# EAGLE design oshcamp23-badge-topper-RevA1 (EAGLE 9.6.2)
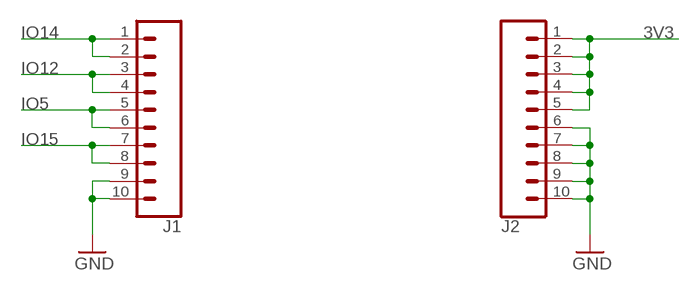
[diagram p0: schematic, sheet 1]

## Parts
J1  CONN_10LOCK  [1X10_LOCK]
J2  CONN_10LOCK  [1X10_LOCK]

## Nets
3V3: J2.1 J2.2 J2.3 J2.4 J2.5
GND: J1.9 J1.10 J2.6 J2.7 J2.8 J2.9 J2.10
IO5: J1.5 J1.6
IO12: J1.3 J1.4
IO14: J1.1 J1.2
IO15: J1.7 J1.8

## Library data of the parts
J1 J2 = SparkFun-Connectors:CONN_10: Multi connection point. Often used as Generic Header-pin footprint for 0.1 inch spaced/style header connections On any of the 0.1 inch spaced packages, you can populate with these: Break Away Headers - Straight <https://www.sparkfun.com/products/116> (PRT-00116) Break Away Male Headers - Right Angle <https://www.sparkfun.com/products/553> (PRT-00553) Female Headers <https://www.sparkfun.com/products/115> (PRT-00115) Break Away Headers - Machine Pin <https://www.sparkfun.com/products/117> (PRT-00117) Break Away Female Headers - Swiss Machine Pin <https://www.sparkfun.com/products/743> (PRT-00743) Arduino Stackable Header - 10 Pin <https://www.sparkfun.com/products/11376> (PRT-11376) For SCREWTERMINALS and SPRING TERMINALS visit here: Screw Terimnals on SparkFun.com <https://www.sparkfun.com/search/results?term=Screw+Terminals> (5mm/3.5mm/2.54mm spacing) This device is also useful as a general connection point to wire up your design to another part of your project. Our various solder wires solder well into these plated through hole pads. Hook-Up Wire - Assortment (Stranded, 22 AWG) <https://www.sparkfun.com/products/11375> (PRT-11375) Hook-Up Wire - Assortment (Solid Core, 22 AWG) <https://www.sparkfun.com/products/11367> (PRT-11367) View the entire wire category on our website here <https://www.sparkfun.com/categories/141> Special notes: Molex polarized connector foot print use with SKU : PRT-08231 with associated crimp pins and housings. 1MM SMD Version SKU: PRT-10208 NOTES ON THE VARIANTS LOCK and LOCK_LONGPADS... This footprint was designed to help hold the alignment of a through-hole component (i.e. 6-pin header) while soldering it into place. You may notice that each hole has been shifted either up or down by 0.005 of an inch from it's more standard position (which is a perfectly straight line). This slight alteration caused the pins (the squares in the middle) to touch the edges of the holes. Because they are alternating, it causes a "brace" to hold the component in place. 0.005 has proven to be the perfect amount of "off-center" position when using our standard breakaway headers. Although looks a little odd when you look at the bare footprint, once you have a header in there, the alteration is very hard to notice. Also,if you push a header all the way into place, it is covered up entirely on the bottom side.

## Board
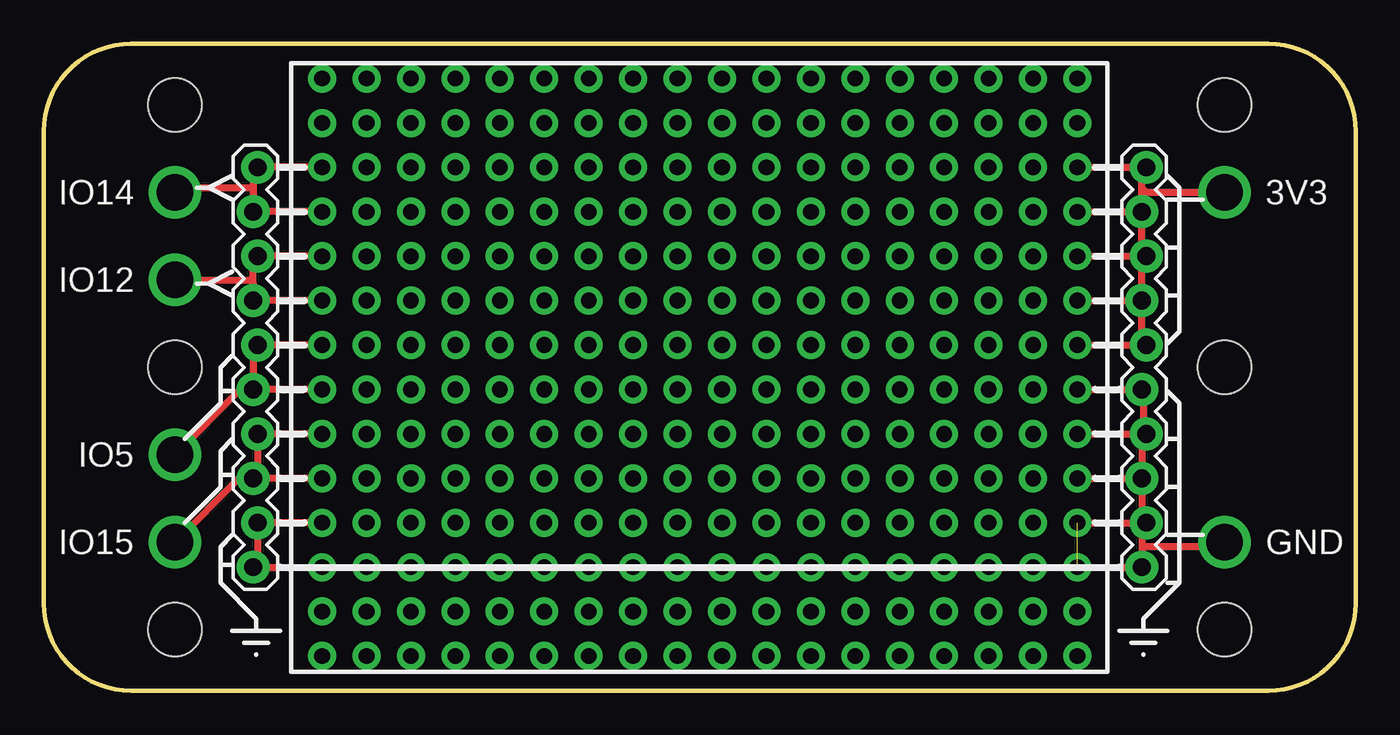
[diagram p1: board, top side]
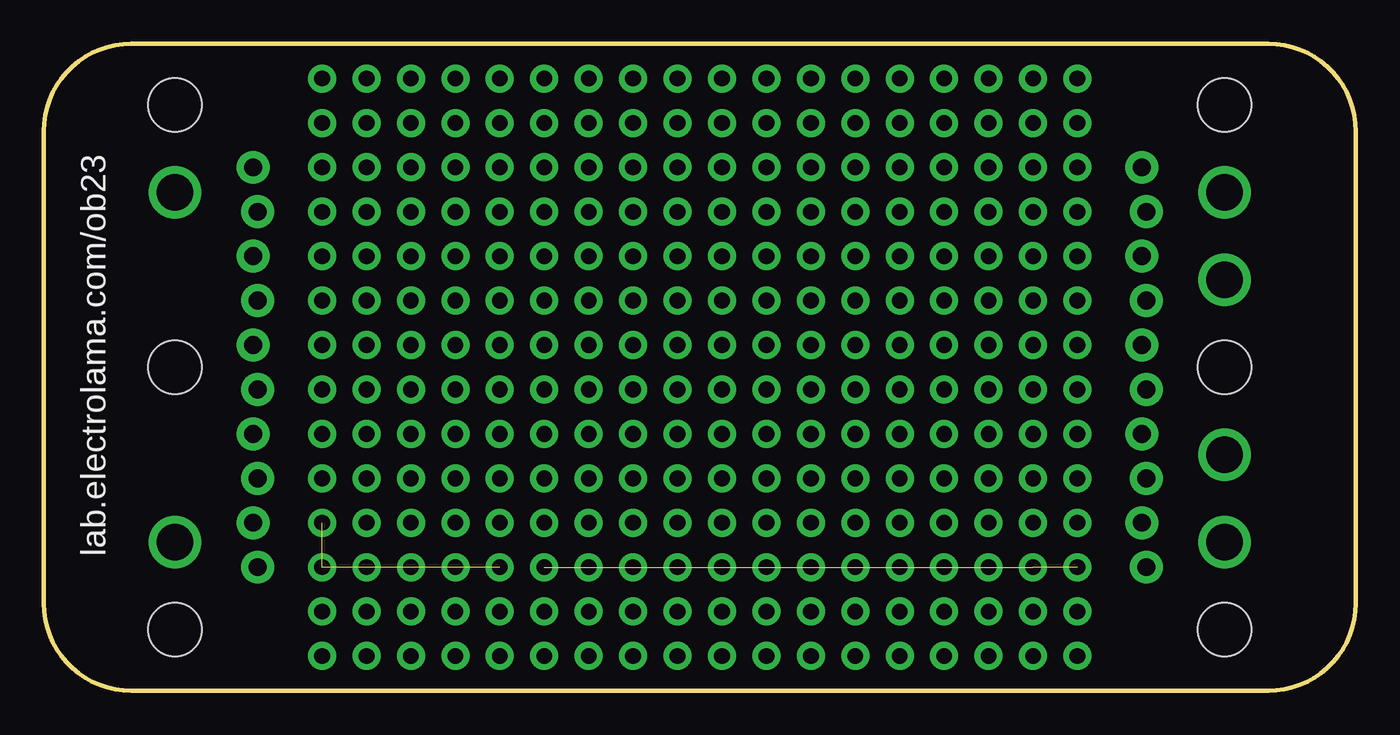
[diagram p2: board, bottom side, seen from below]

Size 75 x 37 mm. Coordinates in mm from the lower left corner, seen from the top.
Outline: 70,37 5,37 arc90 0,32 0,5 arc90 5,0 70,0 arc90 75,5 75,32 arc90 70,37
Copper layers (1*16): Top 0.035mm / dielectric 1.6mm / Bottom 0.035mm
Design rules "jlcpcb-2layers *": minimum track width 5mil, minimum drill 0.3mm, track to track 5mil, track to pad 5mil, pad to pad 5mil, via to via 5mil, smd to smd 5mil, copper to edge 0.2mm, drill to drill 6mil, minimum pad ring 10mil, minimum via ring 3mil, stop-mask expansion 4mil, vias tented up to drill 100mil, thermal gap 10mil
Holes 3.05 mm at 67.5,33.5 67.5,18.5 67.5,3.5 7.5,33.5 7.5,18.5 7.5,3.5

### Footprints (pad centres in the part's own frame; a part is rotated, then mirrored left to right if it is on the bottom)
1X10_LOCK = drill 1.016 pad 1.88: 1 0,0.127; 2 2.54,-0.127; 3 5.08,0.127; 4 7.62,-0.127; 5 10.16,0.127; 6 12.7,-0.127; 7 15.24,0.127; 8 17.78,-0.127; 9 20.32,0.127; 10 22.86,-0.127

### Placement (x,y rotation side)
J1  12.1,29.93 270 top
J2  62.9,29.93 270 top

### Tracks (layer width: path | path; a pad name or v marks a point on that pad's centre or on a via)
3V3  (via drill 0.9 pad 1.6, 2.1 pad 3)
  Top 0.406: v59.09,19.77 J2.5 62.77,20.02 J2.4 | v59.09,22.31 J2.4 | v59.09,24.85 J2.3 | v59.09,27.39 J2.2 | v59.09,29.93 J2.1 62.77,29.68 62.77,28.77 | J2.4 62.77,24.6 J2.3 | J2.3 62.77,25.1 J2.2 | J2.2 62.77,28.77 | v67.5,28.5 63.05,28.5 62.77,28.77
GND  (via drill 0.9 pad 1.6, 2.1 pad 3)  (17 unrouted)
  Top 0.406: v59.09,9.61 J2.9 | v59.09,12.15 J2.8 | v59.09,14.69 62.84,14.69 | 62.84,14.69 J2.7 62.77,14.44 J2.8 | v59.09,17.23 J2.6 62.84,17.16 62.84,14.69 | v15.91,9.61 J1.9 12.23,7.32 J1.10 v15.91,7.07 J2.10 62.77,8.22 | J2.8 62.77,9.86 J2.9 | J2.9 62.77,9.36 62.77,8.22 | v67.5,8.5 67.22,8.22 62.77,8.22
  other vias: 59.09,7.07 18.45,7.07 20.99,7.07 31.15,7.07 41.31,7.07 43.85,7.07 48.93,7.07 51.47,7.07 54.01,7.07 56.55,7.07 38.77,7.07 36.23,7.07 33.69,7.07 28.61,7.07 26.07,7.07 23.53,7.07 46.39,7.07
IO5  (via drill 0.9 pad 1.6, 2.1 pad 3)
  Top 0.406: 11.97,17.82 11.97,19.52 J1.5 v15.91,19.77 | 11.97,17.82 J1.6 11.23,17.23 v7.5,13.5 | v15.91,17.23 12.56,17.23 11.97,17.82
IO12  (via drill 0.9 pad 1.6, 2.1 pad 3)
  Top 0.406: 11.97,23.3 J1.4 v15.91,22.31 | 11.97,23.3 11.97,24.6 J1.3 v15.91,24.85 | v7.5,23.5 11.77,23.5 11.97,23.3
IO14  (via drill 0.9 pad 1.6, 2.1 pad 3)
  Top 0.406: 11.97,28.77 11.97,29.68 J1.1 v15.91,29.93 | 11.97,28.77 11.97,27.41 | 11.97,27.41 J1.2 | v7.5,28.5 7.77,28.77 11.97,28.77 | v15.91,27.39 11.99,27.39 11.97,27.41
IO15  (via drill 0.9 pad 1.6, 2.1 pad 3)
  Top 0.406: v7.5,8.5 11.15,12.15 J1.8 12.23,12.4 | 12.23,12.4 J1.7 v15.91,14.69 | v15.91,12.15 12.48,12.15 12.23,12.4
N$1  (via drill 0.9 pad 1.6)
  other vias: 36.23,19.77
N$2  (via drill 0.9 pad 1.6)
  other vias: 38.77,19.77
N$3  (via drill 0.9 pad 1.6)
  other vias: 36.23,17.23
N$4  (via drill 0.9 pad 1.6)
  other vias: 38.77,17.23
N$5  (via drill 0.9 pad 1.6)
  other vias: 41.31,19.77
N$6  (via drill 0.9 pad 1.6)
  other vias: 43.85,19.77
N$7  (via drill 0.9 pad 1.6)
  other vias: 41.31,17.23
N$8  (via drill 0.9 pad 1.6)
  other vias: 43.85,17.23
N$9  (via drill 0.9 pad 1.6)
  other vias: 46.39,19.77
N$10  (via drill 0.9 pad 1.6)
  other vias: 48.93,19.77
N$11  (via drill 0.9 pad 1.6)
  other vias: 46.39,17.23
N$12  (via drill 0.9 pad 1.6)
  other vias: 48.93,17.23
N$13  (via drill 0.9 pad 1.6)
  other vias: 51.47,19.77
N$14  (via drill 0.9 pad 1.6)
  other vias: 54.01,19.77
N$15  (via drill 0.9 pad 1.6)
  other vias: 51.47,17.23
N$16  (via drill 0.9 pad 1.6)
  other vias: 54.01,17.23
N$17  (via drill 0.9 pad 1.6)
  other vias: 56.55,19.77
N$19  (via drill 0.9 pad 1.6)
  other vias: 56.55,17.23
N$21  (via drill 0.9 pad 1.6)
  other vias: 31.15,19.77
N$22  (via drill 0.9 pad 1.6)
  other vias: 33.69,19.77
N$23  (via drill 0.9 pad 1.6)
  other vias: 31.15,17.23
N$24  (via drill 0.9 pad 1.6)
  other vias: 33.69,17.23
N$25  (via drill 0.9 pad 1.6)
  other vias: 26.07,19.77
N$26  (via drill 0.9 pad 1.6)
  other vias: 28.61,19.77
N$27  (via drill 0.9 pad 1.6)
  other vias: 26.07,17.23
N$28  (via drill 0.9 pad 1.6)
  other vias: 28.61,17.23
N$29  (via drill 0.9 pad 1.6)
  other vias: 20.99,19.77
N$30  (via drill 0.9 pad 1.6)
  other vias: 23.53,19.77
N$31  (via drill 0.9 pad 1.6)
  other vias: 20.99,17.23
N$32  (via drill 0.9 pad 1.6)
  other vias: 23.53,17.23
N$34  (via drill 0.9 pad 1.6)
  other vias: 18.45,19.77
N$36  (via drill 0.9 pad 1.6)
  other vias: 18.45,17.23
N$38  (via drill 0.9 pad 1.6)
  other vias: 18.45,24.85
N$40  (via drill 0.9 pad 1.6)
  other vias: 18.45,22.31
N$41  (via drill 0.9 pad 1.6)
  other vias: 20.99,24.85
N$42  (via drill 0.9 pad 1.6)
  other vias: 23.53,24.85
N$43  (via drill 0.9 pad 1.6)
  other vias: 20.99,22.31
N$44  (via drill 0.9 pad 1.6)
  other vias: 23.53,22.31
N$45  (via drill 0.9 pad 1.6)
  other vias: 26.07,24.85
N$46  (via drill 0.9 pad 1.6)
  other vias: 28.61,24.85
N$47  (via drill 0.9 pad 1.6)
  other vias: 26.07,22.31
N$48  (via drill 0.9 pad 1.6)
  other vias: 28.61,22.31
N$49  (via drill 0.9 pad 1.6)
  other vias: 31.15,24.85
N$50  (via drill 0.9 pad 1.6)
  other vias: 33.69,24.85
N$51  (via drill 0.9 pad 1.6)
  other vias: 31.15,22.31
N$52  (via drill 0.9 pad 1.6)
  other vias: 33.69,22.31
N$53  (via drill 0.9 pad 1.6)
  other vias: 36.23,24.85
N$54  (via drill 0.9 pad 1.6)
  other vias: 38.77,24.85
N$55  (via drill 0.9 pad 1.6)
  other vias: 36.23,22.31
N$56  (via drill 0.9 pad 1.6)
  other vias: 38.77,22.31
N$57  (via drill 0.9 pad 1.6)
  other vias: 41.31,24.85
N$58  (via drill 0.9 pad 1.6)
  other vias: 43.85,24.85
N$59  (via drill 0.9 pad 1.6)
  other vias: 41.31,22.31
N$60  (via drill 0.9 pad 1.6)
  other vias: 43.85,22.31
N$61  (via drill 0.9 pad 1.6)
  other vias: 46.39,24.85
N$62  (via drill 0.9 pad 1.6)
  other vias: 48.93,24.85
N$63  (via drill 0.9 pad 1.6)
  other vias: 46.39,22.31
N$64  (via drill 0.9 pad 1.6)
  other vias: 48.93,22.31
N$65  (via drill 0.9 pad 1.6)
  other vias: 51.47,24.85
N$66  (via drill 0.9 pad 1.6)
  other vias: 54.01,24.85
N$67  (via drill 0.9 pad 1.6)
  other vias: 51.47,22.31
N$68  (via drill 0.9 pad 1.6)
  other vias: 54.01,22.31
N$70  (via drill 0.9 pad 1.6)
  other vias: 18.45,29.93
N$72  (via drill 0.9 pad 1.6)
  other vias: 18.45,27.39
N$73  (via drill 0.9 pad 1.6)
  other vias: 20.99,29.93
N$74  (via drill 0.9 pad 1.6)
  other vias: 23.53,29.93
N$75  (via drill 0.9 pad 1.6)
  other vias: 20.99,27.39
N$76  (via drill 0.9 pad 1.6)
  other vias: 23.53,27.39
N$77  (via drill 0.9 pad 1.6)
  other vias: 15.91,35.01
N$78  (via drill 0.9 pad 1.6)
  other vias: 18.45,35.01
N$79  (via drill 0.9 pad 1.6)
  other vias: 15.91,32.47
N$80  (via drill 0.9 pad 1.6)
  other vias: 18.45,32.47
N$81  (via drill 0.9 pad 1.6)
  other vias: 20.99,35.01
N$82  (via drill 0.9 pad 1.6)
  other vias: 23.53,35.01
N$83  (via drill 0.9 pad 1.6)
  other vias: 20.99,32.47
N$84  (via drill 0.9 pad 1.6)
  other vias: 23.53,32.47
N$85  (via drill 0.9 pad 1.6)
  other vias: 26.07,29.93
N$86  (via drill 0.9 pad 1.6)
  other vias: 28.61,29.93
N$87  (via drill 0.9 pad 1.6)
  other vias: 26.07,27.39
N$88  (via drill 0.9 pad 1.6)
  other vias: 28.61,27.39
N$89  (via drill 0.9 pad 1.6)
  other vias: 31.15,29.93
N$90  (via drill 0.9 pad 1.6)
  other vias: 33.69,29.93
N$91  (via drill 0.9 pad 1.6)
  other vias: 31.15,27.39
N$92  (via drill 0.9 pad 1.6)
  other vias: 33.69,27.39
N$93  (via drill 0.9 pad 1.6)
  other vias: 26.07,35.01
N$94  (via drill 0.9 pad 1.6)
  other vias: 28.61,35.01
N$95  (via drill 0.9 pad 1.6)
  other vias: 26.07,32.47
N$96  (via drill 0.9 pad 1.6)
  other vias: 28.61,32.47
N$97  (via drill 0.9 pad 1.6)
  other vias: 31.15,35.01
N$98  (via drill 0.9 pad 1.6)
  other vias: 33.69,35.01
N$99  (via drill 0.9 pad 1.6)
  other vias: 31.15,32.47
N$100  (via drill 0.9 pad 1.6)
  other vias: 33.69,32.47
N$101  (via drill 0.9 pad 1.6)
  other vias: 36.23,29.93
N$102  (via drill 0.9 pad 1.6)
  other vias: 38.77,29.93
N$103  (via drill 0.9 pad 1.6)
  other vias: 36.23,27.39
N$104  (via drill 0.9 pad 1.6)
  other vias: 38.77,27.39
N$105  (via drill 0.9 pad 1.6)
  other vias: 41.31,29.93
N$106  (via drill 0.9 pad 1.6)
  other vias: 43.85,29.93
N$107  (via drill 0.9 pad 1.6)
  other vias: 41.31,27.39
N$108  (via drill 0.9 pad 1.6)
  other vias: 43.85,27.39
N$109  (via drill 0.9 pad 1.6)
  other vias: 36.23,35.01
N$110  (via drill 0.9 pad 1.6)
  other vias: 38.77,35.01
N$111  (via drill 0.9 pad 1.6)
  other vias: 36.23,32.47
N$112  (via drill 0.9 pad 1.6)
  other vias: 38.77,32.47
N$113  (via drill 0.9 pad 1.6)
  other vias: 41.31,35.01
N$114  (via drill 0.9 pad 1.6)
  other vias: 43.85,35.01
N$115  (via drill 0.9 pad 1.6)
  other vias: 41.31,32.47
N$116  (via drill 0.9 pad 1.6)
  other vias: 43.85,32.47
N$117  (via drill 0.9 pad 1.6)
  other vias: 46.39,29.93
N$118  (via drill 0.9 pad 1.6)
  other vias: 48.93,29.93
N$119  (via drill 0.9 pad 1.6)
  other vias: 46.39,27.39
N$120  (via drill 0.9 pad 1.6)
  other vias: 48.93,27.39
N$121  (via drill 0.9 pad 1.6)
  other vias: 51.47,29.93
N$122  (via drill 0.9 pad 1.6)
  other vias: 54.01,29.93
N$123  (via drill 0.9 pad 1.6)
  other vias: 51.47,27.39
N$124  (via drill 0.9 pad 1.6)
  other vias: 54.01,27.39
N$125  (via drill 0.9 pad 1.6)
  other vias: 46.39,35.01
N$126  (via drill 0.9 pad 1.6)
  other vias: 48.93,35.01
N$127  (via drill 0.9 pad 1.6)
  other vias: 46.39,32.47
N$128  (via drill 0.9 pad 1.6)
  other vias: 48.93,32.47
N$129  (via drill 0.9 pad 1.6)
  other vias: 51.47,35.01
N$130  (via drill 0.9 pad 1.6)
  other vias: 54.01,35.01
N$131  (via drill 0.9 pad 1.6)
  other vias: 51.47,32.47
N$132  (via drill 0.9 pad 1.6)
  other vias: 54.01,32.47
N$133  (via drill 0.9 pad 1.6)
  other vias: 56.55,24.85
N$135  (via drill 0.9 pad 1.6)
  other vias: 56.55,22.31
N$137  (via drill 0.9 pad 1.6)
  other vias: 56.55,29.93
N$139  (via drill 0.9 pad 1.6)
  other vias: 56.55,27.39
N$141  (via drill 0.9 pad 1.6)
  other vias: 56.55,35.01
N$142  (via drill 0.9 pad 1.6)
  other vias: 59.09,35.01
N$143  (via drill 0.9 pad 1.6)
  other vias: 56.55,32.47
N$144  (via drill 0.9 pad 1.6)
  other vias: 59.09,32.47
N$145  (via drill 0.9 pad 1.6)
  other vias: 38.77,4.53
N$146  (via drill 0.9 pad 1.6)
  other vias: 38.77,1.99
N$147  (via drill 0.9 pad 1.6)
  other vias: 41.31,4.53
N$148  (via drill 0.9 pad 1.6)
  other vias: 43.85,4.53
N$149  (via drill 0.9 pad 1.6)
  other vias: 41.31,1.99
N$150  (via drill 0.9 pad 1.6)
  other vias: 43.85,1.99
N$151  (via drill 0.9 pad 1.6)
  other vias: 46.39,4.53
N$152  (via drill 0.9 pad 1.6)
  other vias: 48.93,4.53
N$153  (via drill 0.9 pad 1.6)
  other vias: 46.39,1.99
N$154  (via drill 0.9 pad 1.6)
  other vias: 48.93,1.99
N$155  (via drill 0.9 pad 1.6)
  other vias: 51.47,4.53
N$156  (via drill 0.9 pad 1.6)
  other vias: 54.01,4.53
N$157  (via drill 0.9 pad 1.6)
  other vias: 51.47,1.99
N$158  (via drill 0.9 pad 1.6)
  other vias: 54.01,1.99
N$159  (via drill 0.9 pad 1.6)
  other vias: 38.77,9.61
N$161  (via drill 0.9 pad 1.6)
  other vias: 41.31,9.61
N$162  (via drill 0.9 pad 1.6)
  other vias: 43.85,9.61
N$165  (via drill 0.9 pad 1.6)
  other vias: 38.77,14.69
N$166  (via drill 0.9 pad 1.6)
  other vias: 38.77,12.15
N$167  (via drill 0.9 pad 1.6)
  other vias: 41.31,14.69
N$168  (via drill 0.9 pad 1.6)
  other vias: 43.85,14.69
N$169  (via drill 0.9 pad 1.6)
  other vias: 41.31,12.15
N$170  (via drill 0.9 pad 1.6)
  other vias: 43.85,12.15
N$171  (via drill 0.9 pad 1.6)
  other vias: 46.39,9.61
N$172  (via drill 0.9 pad 1.6)
  other vias: 48.93,9.61
N$175  (via drill 0.9 pad 1.6)
  other vias: 51.47,9.61
N$176  (via drill 0.9 pad 1.6)
  other vias: 54.01,9.61
N$179  (via drill 0.9 pad 1.6)
  other vias: 46.39,14.69
N$180  (via drill 0.9 pad 1.6)
  other vias: 48.93,14.69
N$181  (via drill 0.9 pad 1.6)
  other vias: 46.39,12.15
N$182  (via drill 0.9 pad 1.6)
  other vias: 48.93,12.15
N$183  (via drill 0.9 pad 1.6)
  other vias: 51.47,14.69
N$184  (via drill 0.9 pad 1.6)
  other vias: 54.01,14.69
N$185  (via drill 0.9 pad 1.6)
  other vias: 51.47,12.15
N$186  (via drill 0.9 pad 1.6)
  other vias: 54.01,12.15
N$187  (via drill 0.9 pad 1.6)
  other vias: 56.55,4.53
N$188  (via drill 0.9 pad 1.6)
  other vias: 59.09,4.53
N$189  (via drill 0.9 pad 1.6)
  other vias: 56.55,1.99
N$190  (via drill 0.9 pad 1.6)
  other vias: 59.09,1.99
N$191  (via drill 0.9 pad 1.6)
  other vias: 56.55,9.61
N$195  (via drill 0.9 pad 1.6)
  other vias: 56.55,14.69
N$197  (via drill 0.9 pad 1.6)
  other vias: 56.55,12.15
N$199  (via drill 0.9 pad 1.6)
  other vias: 15.91,4.53
N$200  (via drill 0.9 pad 1.6)
  other vias: 15.91,1.99
N$201  (via drill 0.9 pad 1.6)
  other vias: 18.45,4.53
N$202  (via drill 0.9 pad 1.6)
  other vias: 20.99,4.53
N$203  (via drill 0.9 pad 1.6)
  other vias: 18.45,1.99
N$204  (via drill 0.9 pad 1.6)
  other vias: 20.99,1.99
N$205  (via drill 0.9 pad 1.6)
  other vias: 23.53,4.53
N$206  (via drill 0.9 pad 1.6)
  other vias: 26.07,4.53
N$207  (via drill 0.9 pad 1.6)
  other vias: 23.53,1.99
N$208  (via drill 0.9 pad 1.6)
  other vias: 26.07,1.99
N$209  (via drill 0.9 pad 1.6)
  other vias: 28.61,4.53
N$210  (via drill 0.9 pad 1.6)
  other vias: 31.15,4.53
N$211  (via drill 0.9 pad 1.6)
  other vias: 28.61,1.99
N$212  (via drill 0.9 pad 1.6)
  other vias: 31.15,1.99
N$215  (via drill 0.9 pad 1.6)
  other vias: 18.45,9.61
N$216  (via drill 0.9 pad 1.6)
  other vias: 20.99,9.61
N$221  (via drill 0.9 pad 1.6)
  other vias: 18.45,14.69
N$222  (via drill 0.9 pad 1.6)
  other vias: 20.99,14.69
N$223  (via drill 0.9 pad 1.6)
  other vias: 18.45,12.15
N$224  (via drill 0.9 pad 1.6)
  other vias: 20.99,12.15
N$225  (via drill 0.9 pad 1.6)
  other vias: 23.53,9.61
N$226  (via drill 0.9 pad 1.6)
  other vias: 26.07,9.61
N$229  (via drill 0.9 pad 1.6)
  other vias: 28.61,9.61
N$230  (via drill 0.9 pad 1.6)
  other vias: 31.15,9.61
N$233  (via drill 0.9 pad 1.6)
  other vias: 23.53,14.69
N$234  (via drill 0.9 pad 1.6)
  other vias: 26.07,14.69
N$235  (via drill 0.9 pad 1.6)
  other vias: 23.53,12.15
N$236  (via drill 0.9 pad 1.6)
  other vias: 26.07,12.15
N$237  (via drill 0.9 pad 1.6)
  other vias: 28.61,14.69
N$238  (via drill 0.9 pad 1.6)
  other vias: 31.15,14.69
N$239  (via drill 0.9 pad 1.6)
  other vias: 28.61,12.15
N$240  (via drill 0.9 pad 1.6)
  other vias: 31.15,12.15
N$241  (via drill 0.9 pad 1.6)
  other vias: 33.69,4.53
N$242  (via drill 0.9 pad 1.6)
  other vias: 36.23,4.53
N$243  (via drill 0.9 pad 1.6)
  other vias: 33.69,1.99
N$244  (via drill 0.9 pad 1.6)
  other vias: 36.23,1.99
N$245  (via drill 0.9 pad 1.6)
  other vias: 33.69,9.61
N$246  (via drill 0.9 pad 1.6)
  other vias: 36.23,9.61
N$249  (via drill 0.9 pad 1.6)
  other vias: 33.69,14.69
N$250  (via drill 0.9 pad 1.6)
  other vias: 36.23,14.69
N$251  (via drill 0.9 pad 1.6)
  other vias: 33.69,12.15
N$252  (via drill 0.9 pad 1.6)
  other vias: 36.23,12.15

### Text on the board
tPlace: IO14 | 3V3 | IO12 | IO5 | IO15 | GND
bPlace: lab.electrolama.com/ob23